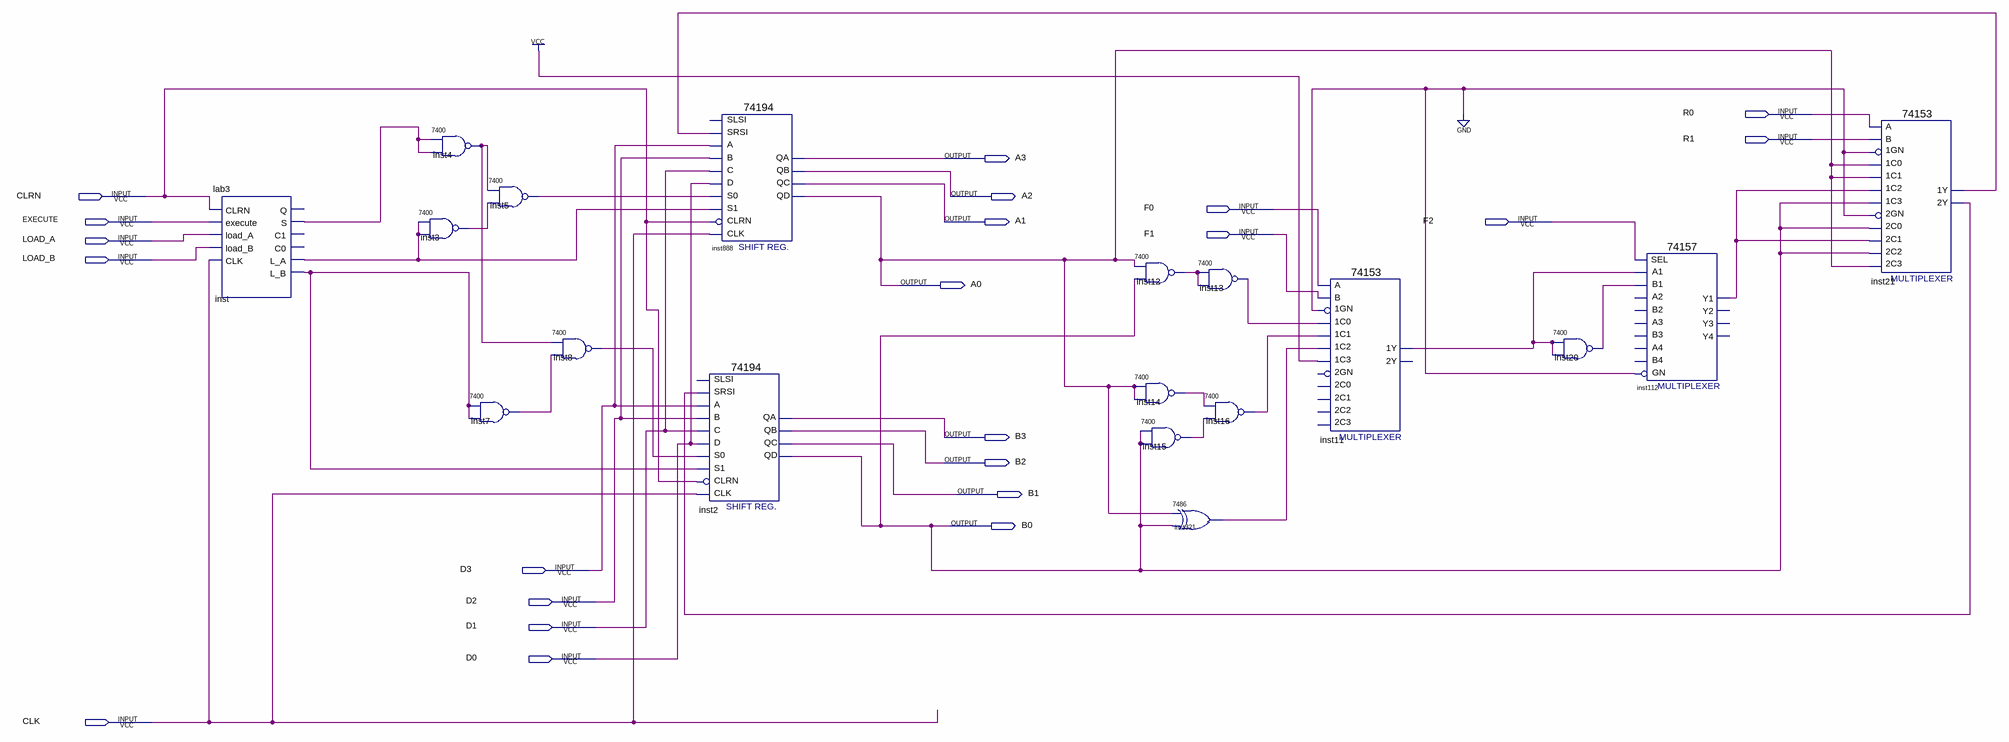
[diagram p0: schematic sheet]
// Quartus schematic Block2.bdf as structural Verilog: 18 symbols, 22 pins
module Block2 (
  input  R0,
  input  R1,
  input  CLRN,
  input  F0,
  input  EXECUTE,
  input  F2,
  input  F1,
  input  LOAD_A,
  input  LOAD_B,
  input  D3,
  input  D2,
  input  D1,
  input  D0,
  input  CLK,
  output A3,
  output A2,
  output A1,
  output A0,
  output B3,
  output B2,
  output B1,
  output B0
);

  wire inst3_1, inst4_1, inst5_1, inst7_1, inst8_1, inst11_1y, inst12_1, inst13_1, inst14_1, inst15_1,
       inst16_1, inst20_1, inst21_1y, inst21_2y, inst112_y1, inst321_1, inst_l_a, inst_l_b, inst_s;

  lab3 inst (
    .CLRN(CLRN), .execute(EXECUTE), .load_A(LOAD_A), .load_B(LOAD_B), .CLK(CLK), .S(inst_s), .L_A(inst_l_a),
    .L_B(inst_l_b));  // open: Q, C1, C0
  \7400  inst4 (.\3 (inst_s), .\2 (inst_s), .\1 (inst4_1));
  \7400  inst3 (.\3 (inst_l_a), .\2 (inst_l_a), .\1 (inst3_1));
  \7400  inst5 (.\3 (inst3_1), .\2 (inst4_1), .\1 (inst5_1));
  \7400  inst7 (.\3 (inst_l_b), .\2 (inst_l_b), .\1 (inst7_1));
  \7400  inst8 (.\3 (inst7_1), .\2 (inst4_1), .\1 (inst8_1));
  \74194  inst2 (
    .SRSI(inst21_2y), .B(D2), .C(D1), .CLK(CLK), .CLRN(CLRN), .D(D0), .S1(inst_l_b), .S0(inst8_1), .A(D3),
    .QA(B3), .QB(B2), .QC(B1), .QD(B0));  // open: SLSI
  \74194  inst888 (
    .SRSI(inst21_1y), .B(D2), .C(D1), .CLK(CLK), .CLRN(CLRN), .D(D0), .S1(inst_l_a), .S0(inst5_1), .A(D3),
    .QA(A3), .QB(A2), .QC(A1), .QD(A0));  // open: SLSI
  \7400  inst12 (.\3 (B0), .\2 (A0), .\1 (inst12_1));
  \7400  inst14 (.\3 (A0), .\2 (A0), .\1 (inst14_1));
  \7400  inst15 (.\3 (B0), .\2 (B0), .\1 (inst15_1));
  \7400  inst13 (.\3 (inst12_1), .\2 (inst12_1), .\1 (inst13_1));
  \7400  inst16 (.\3 (inst15_1), .\2 (inst14_1), .\1 (inst16_1));
  \7486  inst321 (.\2 (A0), .\3 (B0), .\1 (inst321_1));
  \74153  inst11 (
    .\1C1 (inst16_1), .\1GN (1'b0), .\1C0 (inst13_1), .\1C2 (inst321_1), .\1C3 (1'b1), .B(F1), .A(F0),
    .\1Y (inst11_1y));  // open: 2C0, 2GN, 2C2, 2C1, 2C3, 2Y
  \7400  inst20 (.\3 (inst11_1y), .\2 (inst11_1y), .\1 (inst20_1));
  \74157  inst112 (
    .A1(inst11_1y), .B1(inst20_1), .SEL(F2), .GN(1'b0), .Y1(inst112_y1));  // open: B2, A3, B3, A2, B4, A4, Y2, Y4, Y3
  \74153  inst21 (
    .\1C1 (A0), .\1GN (1'b0), .\1C0 (A0), .\2C0 (B0), .\2GN (1'b0), .\2C2 (B0), .\1C2 (inst112_y1),
    .\1C3 (B0), .B(R1), .A(R0), .\2C1 (inst112_y1), .\2C3 (A0), .\1Y (inst21_1y), .\2Y (inst21_2y));
endmodule
